# EasyEDA schematic SCH_Amplifier_2025-05-17.json
TITLE: 16dB OpAmp with Differential Amplifier and MAX318; REV: 1.0; Date: 2024-11-01; Sheet: 1/1; Drawn By: Mahboob Liaquat; Company: Analogic
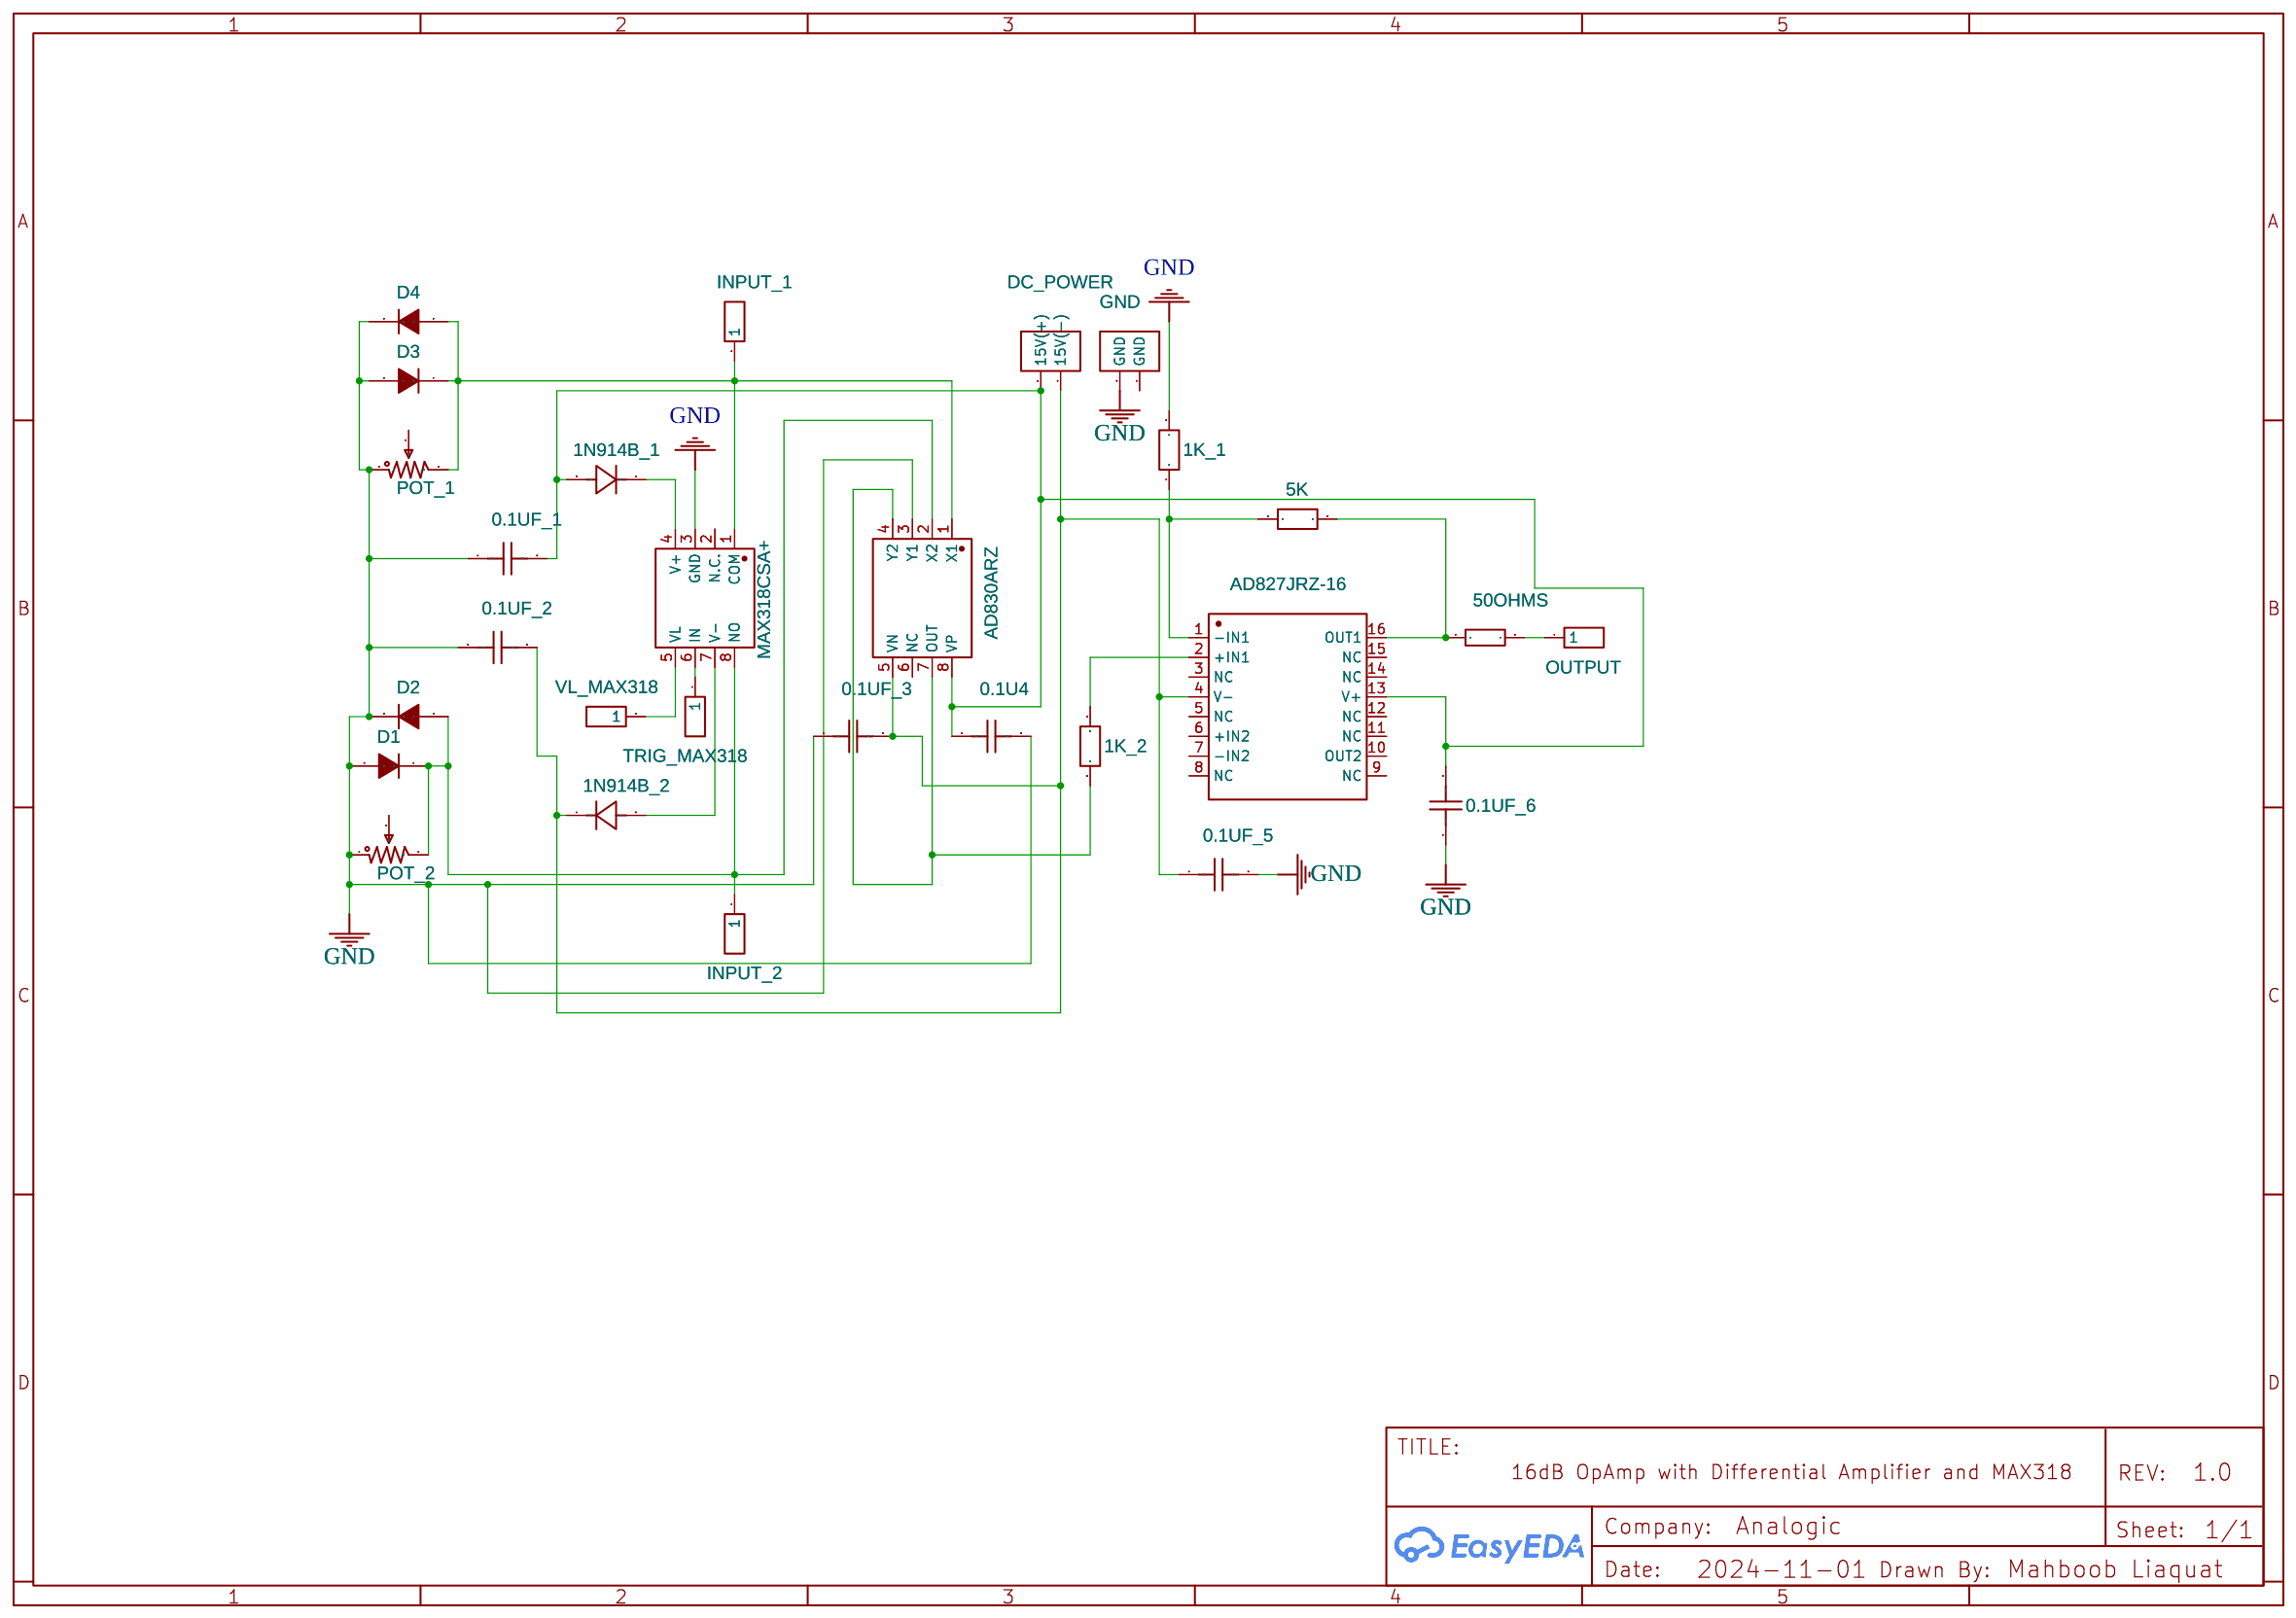
[diagram p0: schematic sheet]

## Parts
0.1U4  100nF  [C0805]
0.1UF_1  100nF  [C0805]
0.1UF_2  100nF  [C0805]
0.1UF_3  100nF  [C0805]
0.1UF_5  100nF  [C0805]
0.1UF_6  100nF  [C0805]
1K_1  100mΩ  [R0603]
1K_2  100mΩ  [R0603]
1N914B_1  1N914B  [DO-35_BD2.0-L4.0-P8.0-D0.5-RD]
1N914B_2  1N914B  [DO-35_BD2.0-L4.0-P8.0-D0.5-RD]
5K  100mΩ  [R0603]
50OHMS  49.9Ω  [R1206]
AD827JRZ-16  AD827JRZ-16  [SOIC-16_L10.3-W7.5-P1.27-LS10.3-BL]
AD830ARZ  AD830ARZ  [SOIC-8_L5.0-W4.0-P1.27-LS6.0-BL]
D1  1N4148TR  [DO-35_BD2.0-L4.2-P8.20-D0.5-RD]
D2  1N4148TR  [DO-35_BD2.0-L4.2-P8.20-D0.5-RD]
D3  1N4148TR  [DO-35_BD2.0-L4.2-P8.20-D0.5-RD]
D4  1N4148TR  [DO-35_BD2.0-L4.2-P8.20-D0.5-RD]
DC_POWER  282836-2  [282836-2]
GND  282836-2  [282836-2]
INPUT_1  HDR-M-2.54_1x1  [HDR-M-2.54_1X1]
INPUT_2  HDR-M-2.54_1x1  [HDR-M-2.54_1X1]
MAX318CSA+  MAX318CSA+  [SOIC-8_L5.0-W4.0-P1.27-LS6.0-BL]
OUTPUT  HDR-M-2.54_1x1  [HDR-M-2.54_1X1]
POT_1  1MΩ  [RES-ADJ-SMD_3P-L7.0-W6.9-P4.80-BL]
POT_2  1MΩ  [RES-ADJ-SMD_3P-L7.0-W6.9-P4.80-BL]
TRIG_MAX318  HDR-M-2.54_1x1  [HDR-M-2.54_1X1]
VL_MAX318  HDR-M-2.54_1x1  [HDR-M-2.54_1X1]

## Library data of the parts
0.1U4 0.1UF_1-0.1UF_3 0.1UF_5 0.1UF_6 = C2012X7T2E104K125AE: Contributor: lcsc; Supplier: LCSC; Supplier Part: C2181172; Manufacturer: TDK; JLCPCB Part Class: Extended Part
1K_1 1K_2 5K = WSLP0603R1000DEA: Supplier: LCSC; Supplier Part: C6327422; Manufacturer: VISHAY(威世); JLCPCB Part Class: Extended Part; Contributor: lcsc
1N914B_1 1N914B_2 = 1N914B: Supplier: LCSC; Supplier Part: C895281; Manufacturer: onsemi(安森美); JLCPCB Part Class: Extended Part; Contributor: lcsc
50OHMS = RC1206FR-0749R9L: Contributor: LCSC; Supplier: LCSC; Supplier Part: C246049; Manufacturer: YAGEO(国巨); JLCPCB Part Class: Extended Part
AD827JRZ-16 = AD827JRZ-16: Contributor: LCSC; Supplier: LCSC; Supplier Part: C652647; Manufacturer: ADI(亚德诺); JLCPCB Part Class: Extended Part
AD830ARZ = AD830ARZ: Contributor: LCSC; Supplier: LCSC; Supplier Part: C652682; Manufacturer: ADI(亚德诺); JLCPCB Part Class: Extended Part
D1-D4 = 1N4148TR: Supplier: LCSC; Manufacturer: onsemi(安森美); Supplier Part: C84410; JLCPCB Part Class: Extended Part
DC_POWER GND = 282836-2: Manufacturer: TE-Connectivity; Contributor: kaziu54321
INPUT_1 INPUT_2 OUTPUT TRIG_MAX318 VL_MAX318 = HDR-M-2.54_1x1: Supplier Part: C81276; Supplier: LCSC; Contributor: LCEDA_Lib
MAX318CSA+ = MAX318CSA+: Contributor: LCSC; Supplier: LCSC; Supplier Part: C1546263; Manufacturer: ADI(亚德诺)/MAXIM(美信); JLCPCB Part Class: Extended Part
POT_1 POT_2 = 3361P-1-105: Supplier: LCSC; Supplier Part: C2910028; Manufacturer: BOCHEN(博晨); JLCPCB Part Class: Extended Part; Contributor: lcsc

## Nets
GND: 0.1U4.2 0.1UF_1.1 0.1UF_2.1 0.1UF_3.1 0.1UF_5.2 0.1UF_6.1 1K_1.2 AD830ARZ.3(Y1) D1.2(A) D2.1(C) D3.2(A) D4.1(C) GND.2(GND) MAX318CSA+.3(GND) POT_1.1 POT_2.1
Net-(0.1U4-1): 0.1U4.1 0.1UF_1.2 0.1UF_6.2 1N914B_1.2(A) AD827JRZ-16.13(V+) AD830ARZ.8(VP) DC_POWER.2(15V(+))
Net-(0.1UF_2-2): 0.1UF_2.2 0.1UF_3.2 0.1UF_5.1 1N914B_2.1(K) AD827JRZ-16.4(V-) AD830ARZ.5(VN) DC_POWER.1(15V(-))
Net-(1K_1-1): 1K_1.1 5K.1 AD827JRZ-16.1(-IN1)
Net-(1K_2-1): 1K_2.1 AD830ARZ.4(Y2) AD830ARZ.7(OUT)
Net-(1K_2-2): 1K_2.2 AD827JRZ-16.2(+IN1)
Net-(1N914B_1-1): 1N914B_1.1(K) MAX318CSA+.4(V+)
Net-(1N914B_2-2): 1N914B_2.2(A) MAX318CSA+.7(V-)
Net-(5K-2): 5K.2 50OHMS.1 AD827JRZ-16.16(OUT1)
Net-(50OHMS-2): 50OHMS.2 OUTPUT.1
Net-(AD830ARZ-1): AD830ARZ.1(X1) D3.1(C) D4.2(A) INPUT_1.1 MAX318CSA+.1(COM) POT_1.3
Net-(AD830ARZ-2): AD830ARZ.2(X2) D1.1(C) D2.2(A) INPUT_2.1 MAX318CSA+.8(NO) POT_2.3
Net-(MAX318CSA+-5): MAX318CSA+.5(VL) VL_MAX318.1
Net-(MAX318CSA+-6): MAX318CSA+.6(IN) TRIG_MAX318.1

Not connected (* = marked no-connect by the designer): AD827JRZ-16 3(NC) 5(NC) 6(+IN2) 7(-IN2) 8(NC) 9(NC) 10(OUT2) 11(NC) 12(NC) 14(NC) 15(NC); AD830ARZ 6(NC); GND 1(GND); MAX318CSA+ 2(N.C.); POT_1 2; POT_2 2
